# Altium schematic sheet OECU_BASE2.SchDoc
size A4; SheetNumber: 2; SheetTotal: 6
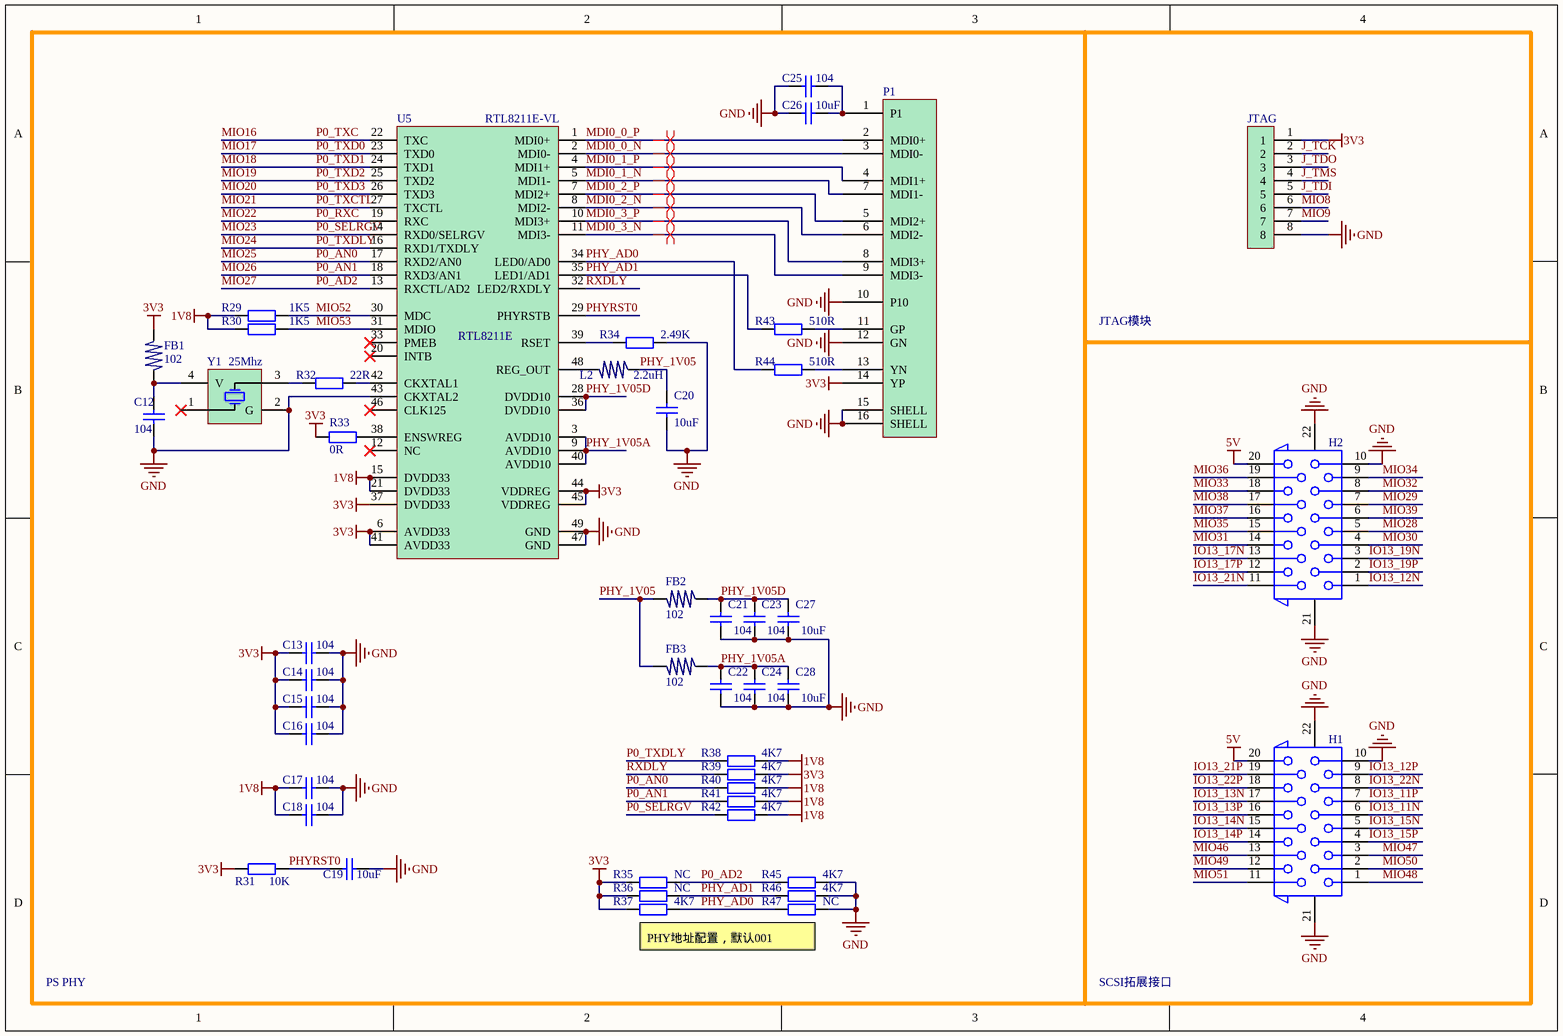
[diagram p0: OECU_BASE2.SchDoc]

## Parts
C12  104  [0402]
C13  104  [0402]
C14  104  [0402]
C15  104  [0402]
C16  104  [0402]
C17  104  [0402]
C18  104  [0402]
C19  10uF  [0402]
C20  10uF  [0402]
C21  104  [0402]
C22  104  [0402]
C23  104  [0402]
C24  104  [0402]
C25  104  [0402]
C26  10uF  [0402]
C27  10uF  [0402]
C28  10uF  [0402]
FB1  102  [0402]
FB2  102  [0603]
FB3  102  [0603]
H1  SCSI20_1  [SCSI20_1]  (value not drawn)
H2  SCSI20_1  [SCSI20_1]  (value not drawn)
JTAG  SH1.25mm_8P  [SH1.25MM_8P]  (value not drawn)
L2  2.2uH  [0805]
P1  RJ45  [HR911130A]  (value not drawn)
R29  1K5  [R_0402]
R30  1K5  [R_0402]
R31  10K  [R_0402]
R32  22R  [R_0402]
R33  0R  [R_0402]
R34  2.49K  [R_0402]
R35  NC  [R_0402]
R36  NC  [R_0402]
R37  4K7  [R_0402]
R38  4K7  [R_0402]
R39  4K7  [R_0402]
R40  4K7  [R_0402]
R41  4K7  [R_0402]
R42  4K7  [R_0402]
R43  510R  [R_0402]
R44  510R  [R_0402]
R45  4K7  [R_0402]
R46  4K7  [R_0402]
R47  NC  [R_0402]
U5  RTL8211E-VL  [QFN48]
Y1  25Mhz  [XTAL_3225]

## Nets
1V8: C17.1 C18.1 R29.2 R30.2 R38.2 R40.2 R41.2 R42.2 U5.15(DVDD33) U5.21(DVDD33)
3V3: C13.1 C14.1 C15.1 C16.1 FB1.2 JTAG.1 P1.14(YP) R31.1 R33.2 R35.1 R36.1 R37.1 R39.2 U5.6(AVDD33) U5.37(DVDD33) U5.41(AVDD33) U5.44(VDDREG) U5.45(VDDREG)
5V: H1.20 H2.20
GND: C12.1 C13.2 C14.2 C15.2 C16.2 C17.2 C18.2 C19.2 C20.1 C21.1 C22.1 C23.1 C24.1 C25.1 C26.1 C27.1 C28.1 H1.10 H1.21(SHELL) H1.22(SHELL) H2.10 H2.21(SHELL) H2.22(SHELL) JTAG.8 P1.10(P10) P1.12(GN) P1.15(SHELL) P1.16(SHELL) R34.2 R45.2 R46.2 R47.2 U5.43(CKXTAL2) U5.47(GND) U5.49(GND) Y1.2(G)
IO13_11N: H1.6
IO13_11P: H1.7
IO13_12N: H2.1
IO13_12P: H1.9
IO13_13N: H1.17
IO13_13P: H1.16
IO13_14N: H1.15
IO13_14P: H1.14
IO13_15N: H1.5
IO13_15P: H1.4
IO13_17N: H2.13
IO13_17P: H2.12
IO13_19N: H2.3
IO13_19P: H2.2
IO13_21N: H2.11
IO13_21P: H1.19
IO13_22N: H1.8
IO13_22P: H1.18
J_TCK: JTAG.2
J_TDI: JTAG.5
J_TDO: JTAG.3
J_TMS: JTAG.4
MDI0_0_N: P1.3(MDI0-) U5.2(MDI0-)
MDI0_0_P: P1.2(MDI0+) U5.1(MDI0+)
MDI0_1_N: P1.7(MDI1-) U5.5(MDI1-)
MDI0_1_P: P1.4(MDI1+) U5.4(MDI1+)
MDI0_2_N: P1.6(MDI2-) U5.8(MDI2-)
MDI0_2_P: P1.5(MDI2+) U5.7(MDI2+)
MDI0_3_N: P1.9(MDI3-) U5.11(MDI3-)
MDI0_3_P: P1.8(MDI3+) U5.10(MDI3+)
MIO8: JTAG.6
MIO9: JTAG.7
MIO16: U5.22(TXC)  [also labelled P0_TXC]
MIO17: U5.23(TXD0)  [also labelled P0_TXD0]
MIO18: U5.24(TXD1)  [also labelled P0_TXD1]
MIO19: U5.25(TXD2)  [also labelled P0_TXD2]
MIO20: U5.26(TXD3)  [also labelled P0_TXD3]
MIO21: U5.27(TXCTL)  [also labelled P0_TXCTL]
MIO22: U5.19(RXC)  [also labelled P0_RXC]
MIO23: R42.1 U5.14(RXD0/SELRGV)  [also labelled P0_SELRGV]
MIO24: R38.1 U5.16(RXD1/TXDLY)  [also labelled P0_TXDLY]
MIO25: R40.1 U5.17(RXD2/AN0)  [also labelled P0_AN0]
MIO26: R41.1 U5.18(RXD3/AN1)  [also labelled P0_AN1]
MIO27: R35.2 R45.1 U5.13(RXCTL/AD2)  [also labelled P0_AD2]
MIO28: H2.5
MIO29: H2.7
MIO30: H2.4
MIO31: H2.14
MIO32: H2.8
MIO33: H2.18
MIO34: H2.9
MIO35: H2.15
MIO36: H2.19
MIO37: H2.16
MIO38: H2.17
MIO39: H2.6
MIO46: H1.13
MIO47: H1.3
MIO48: H1.1
MIO49: H1.12
MIO50: H1.2
MIO51: H1.11
MIO52: R29.1 U5.30(MDC)
MIO53: R30.1 U5.31(MDIO)
PHY_1V05: C20.2 FB2.1 FB3.1 L2.1
PHY_1V05A: C22.2 C24.2 C28.2 FB3.2 U5.3(AVDD10) U5.9(AVDD10) U5.40(AVDD10)
PHY_1V05D: C21.2 C23.2 C27.2 FB2.2 U5.28(DVDD10) U5.36(DVDD10)
PHY_AD0: R37.2 R44.1 R47.1 U5.34(LED0/AD0)
PHY_AD1: R36.2 R43.1 R46.1 U5.35(LED1/AD1)
PHYRST0: C19.1 R31.2 U5.29(PHYRSTB)
RXDLY: R39.1 U5.32(LED2/RXDLY)
NetC12_2: C12.2 FB1.1 Y1.4(V)
NetC25_2: C25.2 C26.2 P1.1(P1)
NetL2_2: L2.2 U5.48(REG_OUT)
NetP1_11: P1.11(GP) R43.2
NetP1_13: P1.13(YN) R44.2
NetR32_1: R32.1 U5.42(CKXTAL1)
NetR32_2: R32.2 Y1.3(OP)
NetR33_1: R33.1 U5.38(ENSWREG)
NetR34_1: R34.1 U5.39(RSET)

Not connected (* = marked no-connect by the designer): U5 12(NC)* 20(INTB)* 33(PMEB)* 46(CLK125)*; Y1 1(EC)*

## Layout directives
differential pair: MDI0_0_N, MDI0_0_P, MDI0_1_N, MDI0_1_P, MDI0_2_N, MDI0_2_P, MDI0_3_N, MDI0_3_P

## Notes on the sheet
- JTAG模块
- PS PHY
- PHY地址配置，默认001
- SCSI拓展接口

## Library data of the parts
C12-C28 = CAP_0402: 贴片电容 0402
FB1 = FB_0402: 磁珠 0402
FB2 FB3 = FB_0603: 磁珠 0603
L2 = L_0805: 电感 0805
P1 = RJ45_HR911130A
R29-R47 = RES_0402: 电阻 0402
U5 = RTL8211E: QFN48
Y1 = XTAL_3225: 贴片有源晶振